# EAGLE design 100 EMBED 1 (EAGLE 5.11)
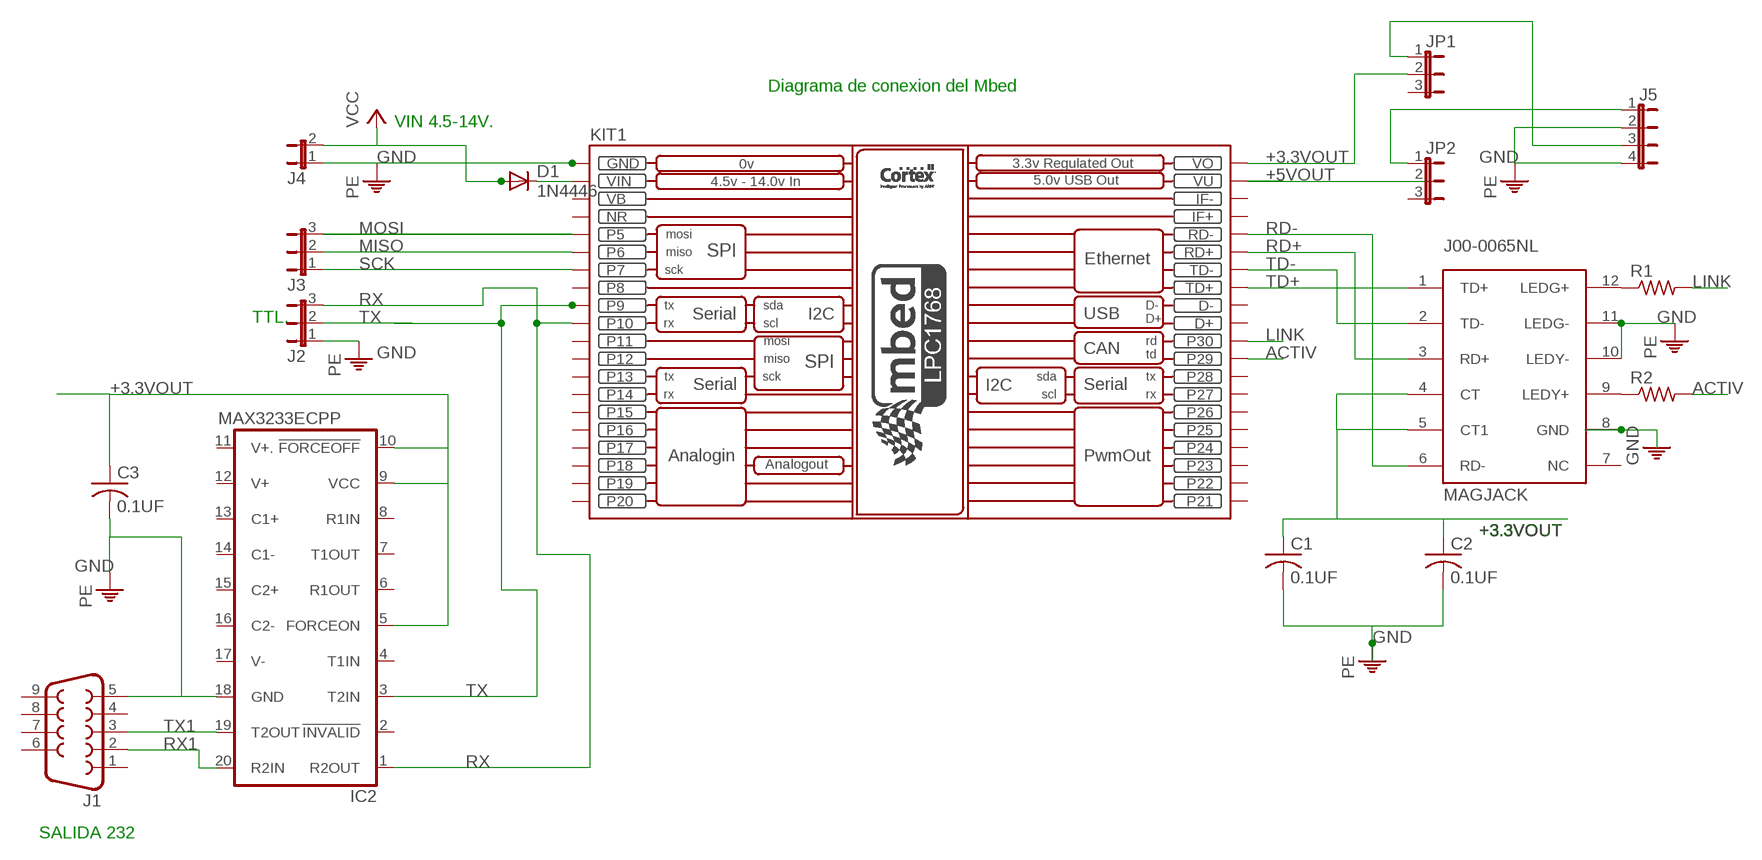
[diagram p0: schematic, sheet 1]

## Parts
C1  0.1UF  C-US025-060X050  [C025-060X050]
C2  0.1UF  C-US025-060X050  [C025-060X050]
C3  0.1UF  C-US025-060X050  [C025-060X050]
D1  1N4446  [DO35-10]
IC2  MAX3233ECPP  [DIL20]
J00-0065NL  MAGJACK  [MAGJACRJ45-1]
J1  DB9  [7457814]
J2  JP2E  [JP2]
J3  JP2E  [JP2]
J4  JP1E  [JP1]
J5  JP4E  [JP4]
JP1  JP2E  [JP2]
JP2  JP2E  [JP2]
KIT1  MBED_NXP_LPC1768  [MBED-KIT]
R1  R-US_0204/5  [0204/5]
R2  R-US_0204/5  [0204/5]

## Nets
+3.3VOUT: C1.1 C2.1 C3.1 IC2.5(FORCEON) IC2.9(VCC) IC2.10(!FORCEOFF) J00-0065NL.4(CT) J00-0065NL.5(CT1) JP1.2 KIT1.VOUT(VO)
+5VOUT: JP2.2 KIT1.VU
ACTIV: KIT1.P$29(P29) R2.2
GND: C1.2 C2.2 C3.2 IC2.18(GND) J00-0065NL.8(GND) J00-0065NL.10(LEDY-) J00-0065NL.11(LEDG-) J1.5 J2.1 J4.1 J5.2 J5.4 KIT1.GND ; supply symbol labelled PE
LINK: KIT1.P$30(P30) R1.2
MISO: J3.2 KIT1.P$6(P6)
MOSI: J3.3 KIT1.P$5(P5)
N$3: J00-0065NL.12(LEDG+) R1.1
N$4: J00-0065NL.9(LEDY+) R2.1
N$5: D1.C KIT1.VIN
N$10: J5.3 JP1.1
N$11: J5.1 JP2.1
RD+: J00-0065NL.3(RD+) KIT1.RD+
RD-: J00-0065NL.6(RD-) KIT1.RD-
RX: IC2.1(R2OUT) J2.3 KIT1.P$10(P10)
RX1: IC2.20(R2IN) J1.2
SCK: J3.1 KIT1.P$7(P7)
TD+: J00-0065NL.1(TD+) KIT1.TD+
TD-: J00-0065NL.2(TD-) KIT1.TD-
TX: IC2.3(T2IN) J2.2 KIT1.P$9(P9)
TX1: IC2.19(T2OUT) J1.3
VCC: D1.A J4.2
Unconnected: IC2.2(!INVALID) IC2.4(T1IN) IC2.6(R1OUT) IC2.7(T1OUT) IC2.8(R1IN) IC2.11(V+.) IC2.12(V+) IC2.13(C1+) IC2.14(C1-) IC2.15(C2+) IC2.16(C2-) IC2.17(V-) J1.1 J1.4 J1.6 J1.7 J1.8 J1.9 JP1.3 JP2.3 KIT1.D+ KIT1.D- KIT1.IF+ KIT1.IF- KIT1.P$8(P8) KIT1.P$11(P11) KIT1.P$12(P12) KIT1.P$13(P13) KIT1.P$14(P14) KIT1.P$15(P15) KIT1.P$16(P16) KIT1.P$17(P17) KIT1.P$18(P18) KIT1.P$19(P19) KIT1.P$20(P20) KIT1.P$21(P21) KIT1.P$22(P22) KIT1.P$23(P23) KIT1.P$24(P24) KIT1.P$25(P25) KIT1.P$26(P26) KIT1.P$27(P27) KIT1.P$28(P28)

## Notes on the sheet
- Diagrama de conexion del Mbed | Diagramama de conexion del MBED
- VIN 4.5-14V.
- TTL.
- +3.3VOUT | +3.3VOUT | +3.3VOUT | +3.3VOUT
- SALIDA 232

## Power pins joined to a net without a drawn wire
NC: J00-0065NL.7(NC)
NR: KIT1.NR
VB: KIT1.VB

## Library data of the parts
C1-C3 = rcl:C-US: CAPACITOR, American symbol
D1 = diode:1N4446: DIODE high speed (Philips)
IC2 = max3233mois:MAX3233E: Dual RS-232 Transceivers with Internal Capacitors ±15kV ESD-Protected, 1µA, 250kbps, 3.3V/5V Source: http://datasheets.maxim-ic.com/en/ds/MAX3233E-MAX3235E.pdf
J00-0065NL = morethanall_magjack:MAGJACK: MORETHANALL MagJack RJ45 with built-in magnetics. Part no. MJF13T3L-KF06B3YG-0808
J1 = ADS:DB9: DB9 Connector
J2 J3 JP1 JP2 = jumper:JP2E: JUMPER
J4 = jumper:JP1E: JUMPER
J5 = jumper:JP4E: JUMPER
KIT1 = SOCKET CONVERTIDOR de MBED_v2.1:MBED_NXP_LPC1768: Mbed LPC1768 - ARM CORTEX v2.1 * Schematic symbol is now placed in eagles's default raster. *The pads diameter are suitable for routing between mbed pins * mbed pads are 0.8 mm drill diameter. --------------------------------------------- Created by: Mohamed Yousry *Alexandria, Egypt *Email: mohamed.yousry@ieeegoldegypt.org
R1 R2 = rcl:R-US_: RESISTOR, American symbol

## Board
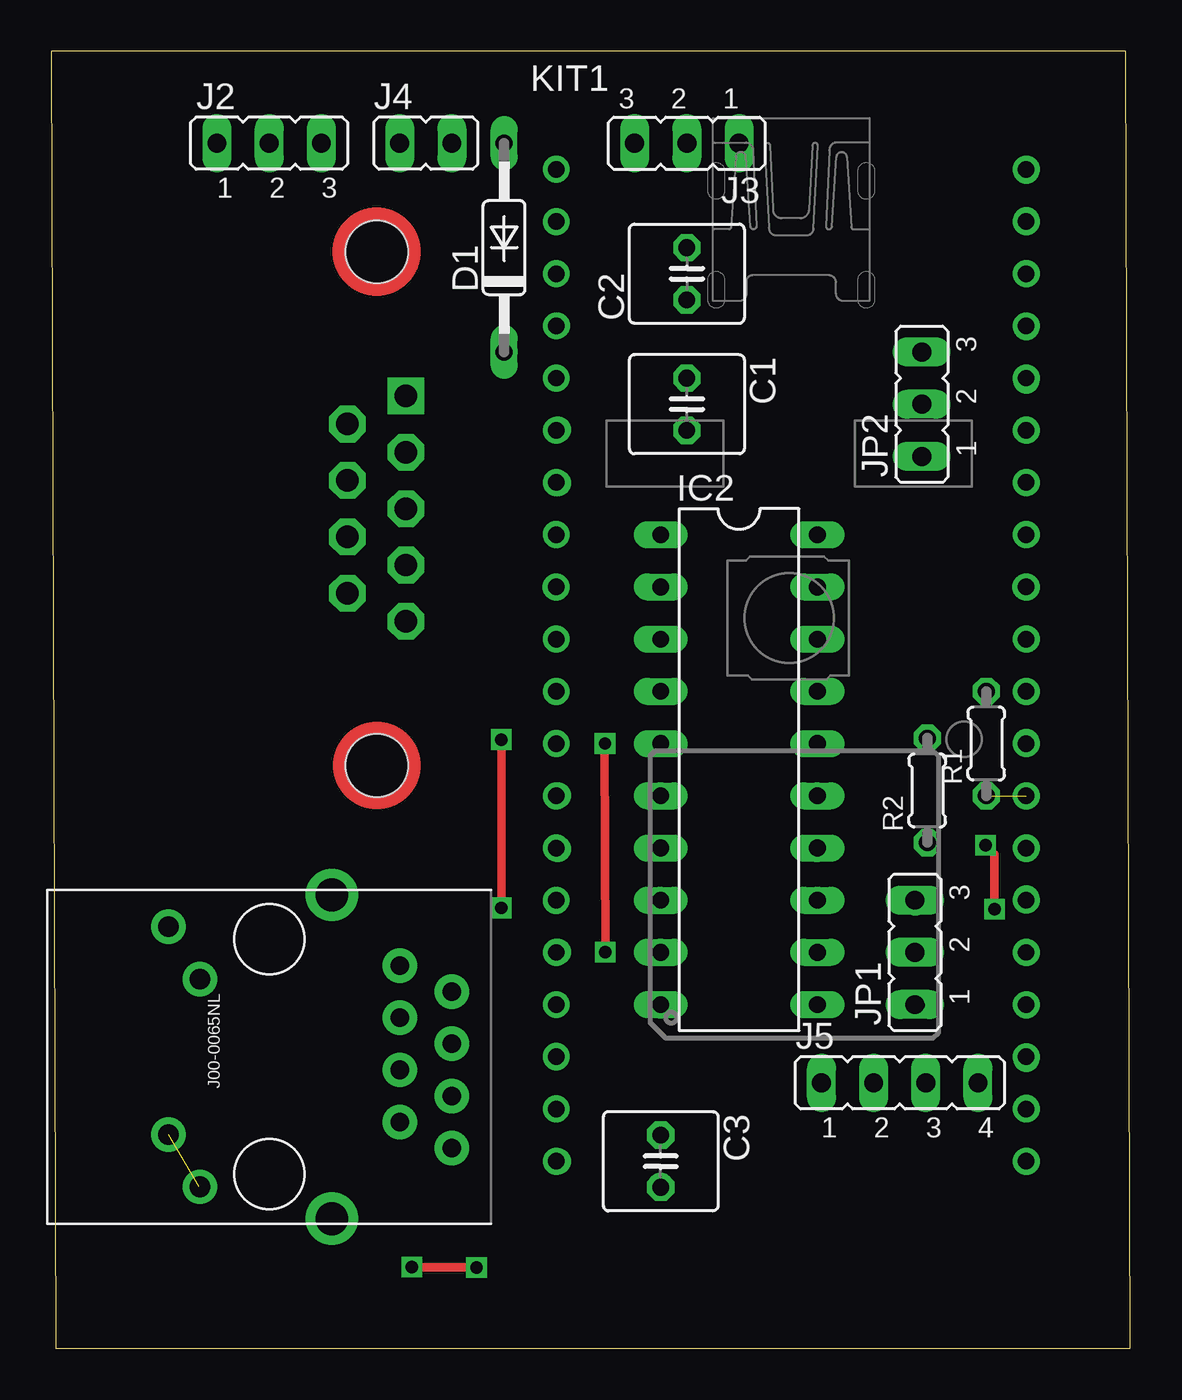
[diagram p1: board, top side]
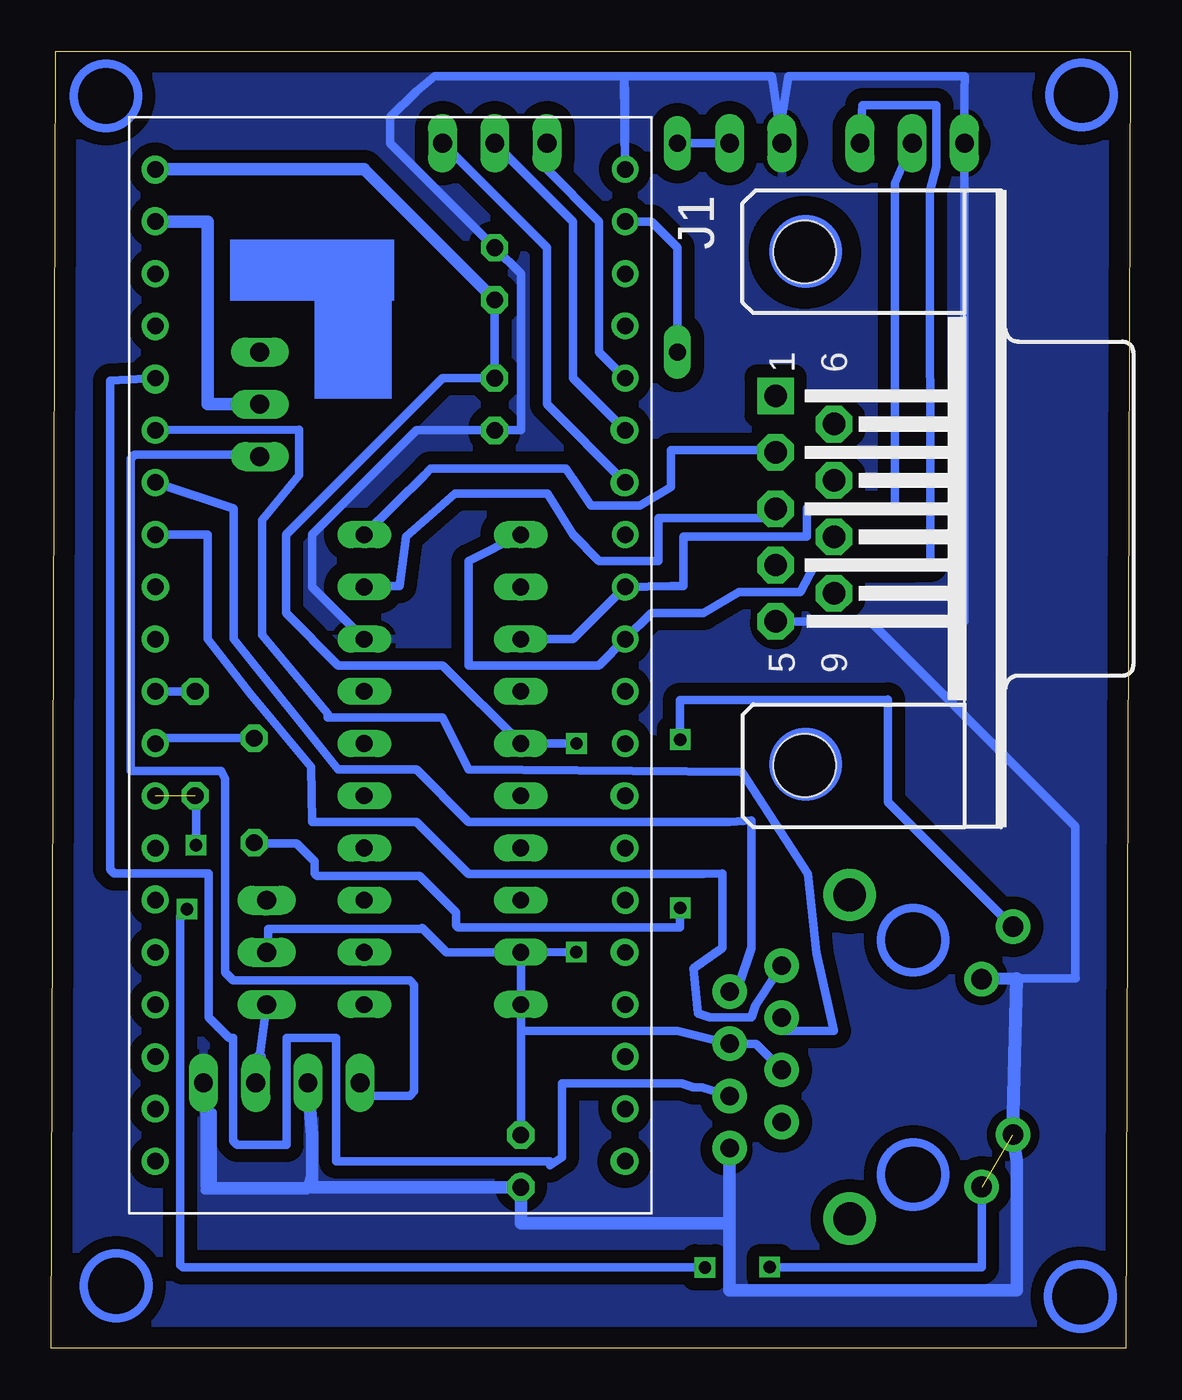
[diagram p2: board, bottom side, seen from below]

Size 52.49 x 63.09 mm. Coordinates in mm from the lower left corner, seen from the top.
Outline: 0.22,0 52.49,0 52.27,63.09 0,63.09 0.22,0
Copper layers (1*16): Top 0.035mm / dielectric 1.5mm / Bottom 0.035mm
Design rules "default *": minimum track width 10mil, minimum drill 24mil, track to track 25mil, track to pad 25mil, pad to pad 25mil, via to via 25mil, smd to smd 25mil, copper to edge 40mil, drill to drill 8mil, minimum pad ring 10mil, minimum via ring 8mil, stop-mask expansion 4mil, vias tented up to drill 0mil, thermal gap 10mil

### Footprints (pad centres in the part's own frame; a part is rotated, then mirrored left to right if it is on the bottom)
C025-060X050 = drill 0.813 octagon: 1 -1.27,0; 2 1.27,0
DO35-10 = drill 0.813 long: A 5.08,0; C -5.08,0
DIL20 = drill 0.813 long: 1 -11.43,-3.81; 2 -8.89,-3.81; 3 -6.35,-3.81; 4 -3.81,-3.81; 5 -1.27,-3.81; 6 1.27,-3.81; 7 3.81,-3.81; 8 6.35,-3.81; 9 8.89,-3.81; 10 11.43,-3.81; 11 11.43,3.81; 12 8.89,3.81; 13 6.35,3.81; 14 3.81,3.81; 15 1.27,3.81; 16 -1.27,3.81; 17 -3.81,3.81; 18 -6.35,3.81; 19 -8.89,3.81; 20 -11.43,3.81
MAGJACRJ45-1 = drill 0.9 pad 1.676 round: 1 4.445,-6.35; 2 3.175,-8.89; 3 1.905,-6.35; 4 0.635,-8.89; 5 -0.635,-6.35; 6 -1.905,-8.89; 7 -3.175,-6.35; 8 -4.445,-8.89 | drill 1 pad 1.676 round: 9 6.325,4.9; 10 3.785,3.38; 11 -3.785,4.9; 12 -6.325,3.38 | drill 1.6 pad 2.54 round: S1 -7.875,-3.05; S2 7.875,-3.05
7457814 = drill 1.092 pad 1.778 square: 1 -5.486,-7.925 | drill 1.092 pad 1.778 octagon: 2 -2.743,-7.925; 3 0,-7.925; 4 2.743,-7.925; 5 5.486,-7.925; 6 -4.115,-5.08; 7 -1.372,-5.08; 8 1.372,-5.08; 9 4.115,-5.08 | hole 3.048: -12.497,-6.502; 12.497,-6.502
JP2 = drill 0.914 long: 1 -2.54,0; 2 0,0; 3 2.54,0
JP1 = drill 0.914 long: 1 0,-1.27; 2 0,1.27
JP4 = drill 0.914 long: 1 -3.81,0; 2 -1.27,0; 3 1.27,0; 4 3.81,0
MBED-KIT = drill 0.8 round: D+ 11.43,1.27; D- 11.43,3.81; GND -11.43,24.13; IF+ 11.43,16.51; IF- 11.43,19.05; NR -11.43,16.51; P$5 -11.43,13.97; P$6 -11.43,11.43; P$7 -11.43,8.89; P$8 -11.43,6.35; P$9 -11.43,3.81; P$10 -11.43,1.27; P$11 -11.43,-1.27; P$12 -11.43,-3.81; P$13 -11.43,-6.35; P$14 -11.43,-8.89; P$15 -11.43,-11.43; P$16 -11.43,-13.97; P$17 -11.43,-16.51; P$18 -11.43,-19.05; P$19 -11.43,-21.59; P$20 -11.43,-24.13; P$21 11.43,-24.13; P$22 11.43,-21.59; P$23 11.43,-19.05; P$24 11.43,-16.51; P$25 11.43,-13.97; P$26 11.43,-11.43; P$27 11.43,-8.89; P$28 11.43,-6.35; P$29 11.43,-3.81; P$30 11.43,-1.27; RD+ 11.43,11.43; RD- 11.43,13.97; TD+ 11.43,6.35; TD- 11.43,8.89; VB -11.43,19.05; VIN -11.43,21.59; VOUT 11.43,24.13; VU 11.43,21.59
0204/5 = drill 0.813 octagon: 1 -2.54,0; 2 2.54,0

### Placement (x,y rotation side)
C1  30.92,45.92 270 top
C2  30.92,52.27 90 top
C3  29.65,9.09 270 top
D1  22.03,53.54 90 top
IC2  33.46,28.14 270 top
J00-0065NL  10.6,14.17 90 top
J1  9.33,40.84 270 bottom
J2  10.6,58.62 0 top
J3  30.92,58.62 180 top
J4  18.22,58.62 270 top
J5  41.28,12.9 0 top
JP1  42.02,19.25 90 top
JP2  42.35,45.92 90 top
KIT1  36,33.22 0 top
R1  45.49,29.41 90 top
R2  42.62,27.13 90 top

### Tracks (layer width: path | path; a pad name or v marks a point on that pad's centre or on a via)
+3.3VOUT  (via drill 0.6)
  Top 0.406: v26.94,29.42 26.92,29.4 v26.95,19.27
  Bottom 0.406: IC2.9 IC2.10 29.65,15.44 | J00-0065NL.5 18.22,14.81 J00-0065NL.4 22.03,15.44 29.65,15.44 | C2.1 C1.1 33.46,47.19 41.08,39.57 41.08,35.76 38.54,33.22 33.46,33.22 IC2.5 v26.94,29.42 | 29.65,15.44 C3.1 | JP1.2 41.95,19.25 41.95,20.4 34.45,20.4 34.45,20.43 33.27,19.25 IC2.9 | v26.95,19.27 29.08,19.25 IC2.9
  Bottom 0.61: KIT1.VOUT 37.27,57.35 C2.1
+5VOUT
  Bottom 0.61: KIT1.VU 44.89,54.81 44.89,45.92 JP2.2
ACTIV
  Bottom 0.406: 47.44,29.68 KIT1.P$29 47.44,29.68 | R2.2 47.43,29.68 | 47.43,29.68 47.44,29.68 | R2.2 47.43,29.68 | 47.43,29.68 47.44,29.68 | R2.2 47.43,29.68 | 47.43,29.68 47.44,29.68 | 47.43,29.68 R2.2
GND
  Bottom 0.406: IC2.18 39.81,37.03 39.81,39.57 34.73,44.65 C1.2 29.65,44.65 29.65,52.27 C2.2 36,58.62 36,59.89 34.73,61.16 33.84,61.88 24.64,61.88 | 39.81,10.36 39.84,8.48 40.04,7.88 44.64,7.88 | 44.64,7.88 45.04,7.88 45.04,12.28 | 45.04,12.28 44.84,11.48 44.64,11.48 44.64,7.88 | 44.64,7.88 45.04,7.68 40.04,7.68 | 45.04,12.28 J5.4 | 24.64,61.88 17.44,61.88 J4.1 16.95,59.89 16.64,61.88 8.04,61.88 8.06,61.16 J2.1 8.06,39.22 8.07,35.35 J1.5 12.64,35.36 2.67,25.39 2.67,18.03 2.64,18 7.18,18 J00-0065NL.10 | 24.64,61.88 24.57,61.16 KIT1.GND 24.64,61.88
  Bottom 0.61: J5.2 39.81,10.36 39.81,7.82 C3.2 29.65,6.08 19.49,6.08 | 19.49,6.08 19.49,2.81 5.52,2.81 5.52,9.09 | 19.49,6.08 J00-0065NL.8 | 5.52,9.09 J00-0065NL.11 | J00-0065NL.11 5.52,17.98 | 5.52,17.98 J00-0065NL.10 | J00-0065NL.11 5.52,17.98 | 5.71,10.39 5.53,17.98 | 5.52,9.09 J00-0065NL.11 | 5.72,10.39 5.54,17.98
  pour Bottom: 54.04,63.88 53.84,63.88 53.84,0.88 -1.56,0.88 -2.96,0.88 -2.96,64.08 -2.36,64.08
LINK
  Bottom 0.406: R1.2 KIT1.P$30
MISO
  Bottom 0.406: J3.2 27.11,54.81 27.11,47.19 KIT1.P$6
MOSI
  Bottom 0.406: KIT1.P$5 25.84,48.46 25.84,54.81 28.38,57.35 J3.3
N$2  (via drill 0.5 pad 1.27)
  other vias: 24.64,26.88
N$3  (via drill 0.6)
  Top 0.406: v45.46,24.46 45.89,24.03 v45.89,21.35 | v20.69,3.92 20.67,3.94 v17.53,3.94
  Bottom 0.406: R1.1 45.46,26.84 v45.46,24.46 | v45.89,21.35 46.22,21.02 46.22,4.03 46.11,3.92 v20.69,3.92 | v17.53,3.94 7.23,3.94 7.22,3.95 J00-0065NL.12
N$4  (via drill 0.6)
  Top 0.406: v21.89,29.61 v21.89,21.42
  Bottom 0.406: R2.1 42.59,24.57 40.57,24.57 39.68,23.68 39.68,23.1 39.56,22.98 34.58,22.98 32.8,21.2 32.8,20.56 32.71,20.47 21.89,20.47 v21.89,21.42 | J00-0065NL.9 11.78,26.58 11.78,31.56 11.81,31.53 21.89,31.53 v21.89,29.61
N$5
  Bottom 0.406: KIT1.VIN 23.3,54.81 22.03,53.54 D1.C
N$10
  Bottom 0.406: 42.35,14.17 JP1.1
  Bottom 0.61: J5.3 42.35,14.17
N$11
  Bottom 0.406: JP2.1 42.45,43.48 48.44,43.48 48.64,43.28 48.64,28.08 44.24,28.08 44.04,27.68 44.04,18.28 43.64,17.88 35.04,17.88 34.84,17.68 34.84,12.48 35.04,12.28 37.64,12.28 37.47,12.45 J5.1
N$32  (via drill 0.5 pad 1.27)
  other vias: 14.38,44.94
N$33  (via drill 0.5 pad 1.27)
  other vias: 17.24,43.55
N$34  (via drill 0.5 pad 1.27)
  other vias: 17.27,46.32
N$35  (via drill 0.5 pad 1.27)
  other vias: 14.4,42.22
N$36  (via drill 0.5 pad 1.27)
  other vias: 14.44,39.48
N$37  (via drill 0.5 pad 1.27)
  other vias: 14.42,36.72
N$38  (via drill 0.5 pad 1.27)
  other vias: 17.24,38.08
N$39  (via drill 0.5 pad 1.27)
  other vias: 17.24,35.28
N$40  (via drill 0.5 pad 1.27)
  other vias: 24.58,57.37
N$41  (via drill 0.5 pad 1.27)
  other vias: 24.59,54.81
N$42  (via drill 0.5 pad 1.27)
  other vias: 24.56,52.27
N$43  (via drill 0.5 pad 1.27)
  other vias: 24.6,49.76
N$44  (via drill 0.5 pad 1.27)
  other vias: 24.57,47.2
N$45  (via drill 0.5 pad 1.27)
  other vias: 24.64,44.68
N$46  (via drill 0.5 pad 1.27)
  other vias: 24.64,42.08
N$47  (via drill 0.5 pad 1.27)
  other vias: 24.56,39.61
N$48  (via drill 0.5 pad 1.27)
  other vias: 24.54,37.03
N$49  (via drill 0.5 pad 1.27)
  other vias: 24.57,34.51
N$50  (via drill 0.5 pad 1.27)
  other vias: 45.5,31.96
N$53  (via drill 0.5 pad 1.27)
  other vias: 24.64,24.28
N$54  (via drill 0.5 pad 1.27)
  other vias: 24.55,21.77
N$55  (via drill 0.5 pad 1.27)
  other vias: 24.64,19.28
N$56  (via drill 0.5 pad 1.27)
  other vias: 24.56,16.72
N$57  (via drill 0.5 pad 1.27)
  other vias: 24.56,14.21
N$58  (via drill 0.5 pad 1.27)
  other vias: 24.57,11.63
N$59  (via drill 0.5 pad 1.27)
  other vias: 24.64,9.08
N$60  (via drill 0.5 pad 1.27)
  other vias: 29.64,7.88
N$61  (via drill 0.5 pad 1.27)
  other vias: 29.65,10.38
N$62  (via drill 0.5 pad 1.27)
  other vias: 29.64,16.68
N$63  (via drill 0.5 pad 1.27)
  other vias: 29.64,19.28
N$64  (via drill 0.5 pad 1.27)
  other vias: 29.63,21.81
N$65  (via drill 0.5 pad 1.27)
  other vias: 29.63,24.34
N$66  (via drill 0.5 pad 1.27)
  other vias: 29.64,26.88
N$67  (via drill 0.5 pad 1.27)
  other vias: 29.64,29.39
N$68  (via drill 0.5 pad 1.27)
  other vias: 29.64,31.92
N$69  (via drill 0.5 pad 1.27)
  other vias: 29.64,34.48
N$70  (via drill 0.5 pad 1.27)
  other vias: 29.66,37
N$71  (via drill 0.5 pad 1.27)
  other vias: 29.64,39.55
N$72  (via drill 0.5 pad 1.27)
  other vias: 37.26,39.56
N$73  (via drill 0.5 pad 1.27)
  other vias: 37.26,37.03
N$74  (via drill 0.5 pad 1.27)
  other vias: 37.3,34.49
N$75  (via drill 0.5 pad 1.27)
  other vias: 37.27,31.95
N$76  (via drill 0.5 pad 1.27)
  other vias: 37.29,29.42
N$77  (via drill 0.5 pad 1.27)
  other vias: 37.26,26.88
N$78  (via drill 0.5 pad 1.27)
  other vias: 37.25,24.3
N$79  (via drill 0.5 pad 1.27)
  other vias: 37.27,21.79
N$80  (via drill 0.5 pad 1.27)
  other vias: 37.24,19.24
N$81  (via drill 0.5 pad 1.27)
  other vias: 37.24,16.73
N$82  (via drill 0.5 pad 1.27)
  other vias: 42.24,16.68
N$83  (via drill 0.5 pad 1.27)
  other vias: 42.04,19.28
N$84  (via drill 0.5 pad 1.27)
  other vias: 42.04,21.68
N$85  (via drill 0.5 pad 1.27)
  other vias: 42.61,24.59
N$86  (via drill 0.5 pad 1.27)
  other vias: 42.64,29.68
N$87  (via drill 0.5 pad 1.27)
  other vias: 47.44,57.28
N$88  (via drill 0.5 pad 1.27)
  other vias: 47.44,54.88
N$89  (via drill 0.5 pad 1.27)
  other vias: 47.44,52.28
N$90  (via drill 0.5 pad 1.27)
  other vias: 47.44,49.68
N$91  (via drill 0.5 pad 1.27)
  other vias: 47.44,47.08
N$92  (via drill 0.5 pad 1.27)
  other vias: 47.44,44.68
N$93  (via drill 0.5 pad 1.27)
  other vias: 47.44,42.08
N$94  (via drill 0.5 pad 1.27)
  other vias: 47.43,39.57
N$95  (via drill 0.5 pad 1.27)
  other vias: 47.39,37.02
N$96  (via drill 0.5 pad 1.27)
  other vias: 47.44,34.48
N$97  (via drill 0.5 pad 1.27)
  other vias: 47.41,31.94
N$98  (via drill 0.5 pad 1.27)
  other vias: 47.44,29.48
N$99  (via drill 0.5 pad 1.27)  (1 unrouted)
  other vias: 47.44,26.87 45.5,26.87
N$100  (via drill 0.5 pad 1.27)
  other vias: 47.44,24.28
N$101  (via drill 0.5 pad 1.27)
  other vias: 47.44,21.88
N$102  (via drill 0.5 pad 1.27)
  other vias: 47.44,19.28
N$103  (via drill 0.5 pad 1.27)
  other vias: 47.44,16.68
N$104  (via drill 0.5 pad 1.27)
  other vias: 47.44,14.08
N$105  (via drill 0.5 pad 1.27)
  other vias: 47.44,11.68
N$106  (via drill 0.5 pad 1.27)
  other vias: 47.42,9.1
N$107  (via drill 0.5 pad 1.27)
  other vias: 33.46,58.61
N$108  (via drill 0.5 pad 1.27)
  other vias: 30.92,58.62
N$109  (via drill 0.5 pad 1.27)
  other vias: 28.37,58.62
N$110  (via drill 0.5 pad 1.27)
  other vias: 22.01,58.62
N$111  (via drill 0.5 pad 1.27)
  other vias: 19.5,58.63
N$112  (via drill 0.5 pad 1.27)
  other vias: 16.95,58.63
N$113  (via drill 0.5 pad 1.27)
  other vias: 13.16,58.59
N$114  (via drill 0.5 pad 1.27)
  other vias: 10.6,58.57
N$115  (via drill 0.5 pad 1.27)
  other vias: 8.08,58.62
N$116  (via drill 0.5 pad 1.27)
  other vias: 30.93,53.57
N$117  (via drill 0.5 pad 1.27)
  other vias: 30.9,51.01
N$118  (via drill 0.5 pad 1.27)
  other vias: 30.91,47.21
N$119  (via drill 0.5 pad 1.27)
  other vias: 30.93,44.66
N$120  (via drill 0.5 pad 1.27)
  other vias: 16.95,18.65
N$121  (via drill 0.5 pad 1.27)
  other vias: 19.49,17.36
N$122  (via drill 0.5 pad 1.27)
  other vias: 19.5,14.82
N$123  (via drill 0.5 pad 1.27)
  other vias: 16.98,16.08
N$124  (via drill 0.5 pad 1.27)
  other vias: 16.96,13.53
N$125  (via drill 0.5 pad 1.27)
  other vias: 19.49,12.27
N$126  (via drill 0.5 pad 1.27)
  other vias: 19.64,9.68
N$127  (via drill 0.5 pad 1.27)
  other vias: 16.96,11.01
N$128  (via drill 0.5 pad 1.27)
  other vias: 5.71,20.49
N$130  (via drill 0.5 pad 1.27)  (1 unrouted)
  other vias: 5.7,10.38 7.2,7.84
N$132  (via drill 0.5 pad 1.27)
  other vias: 7.23,17.97
N$133  (via drill 0.5 pad 1.27)
  other vias: 42.34,48.46
N$134  (via drill 0.5 pad 1.27)
  other vias: 42.38,45.9
N$135  (via drill 0.5 pad 1.27)
  other vias: 42.36,43.38
N$136  (via drill 0.5 pad 1.27)
  other vias: 17.24,40.88
N$137  (via drill 0.5 pad 1.27)
  other vias: 22.04,48.48
RD+
  Bottom 0.406: J00-0065NL.3 16.95,15.44 14.41,15.44 15.27,19.22 15.68,23.06 18.89,28.03 32.19,28.14 33.46,30.68 39.04,30.68 39.04,30.88 42.24,34.68 42.24,40.28 40.44,42.48 40.44,44.68 KIT1.RD+
RD-
  Bottom 0.406: J00-0065NL.6 20.84,12.68 21.24,12.68 21.84,12.88 27.64,12.88 27.64,9.28 28.24,8.88 28.24,9.08 38.64,9.08 38.64,15.08 41.04,15.08 41.04,9.88 43.44,9.88 43.64,10.08 43.64,15.08 43.84,15.08 44.84,16.08 44.84,23.08 49.44,23.08 49.64,23.28 49.64,47.08 KIT1.RD-
RX
  Bottom 0.406: IC2.1 32.19,38.3 32.19,33.22 25.84,33.22 KIT1.P$10 23.3,35.76 20.76,35.76 19.04,36.78 16.04,36.78 15.36,38.08 10.58,38.08 9.71,38.1 9.74,56.28 9.44,57.48 9.44,60.48 13.04,60.48 J2.3
RX1
  Bottom 0.406: IC2.20 34.34,42.48 34.04,42.78 27.44,42.78 26.24,40.98 23.84,40.98 22.34,41.88 22.34,43.68 17.84,43.68 J1.2
SCK
  Bottom 0.406: J3.1 28.38,53.54 28.38,45.92 KIT1.P$7
TD+
  Bottom 0.406: KIT1.TD+ 44.89,39.57 44.89,34.49 42.84,31.88 39.84,28.28 39.81,25.6 34.73,25.6 32.19,23.06 20.76,23.06 19.84,23.08 19.84,19.48 21.24,18.48 21.04,16.28 20.44,16.08 18.44,16.08 18.24,16.68 17.24,18.18 16.95,18.47 J00-0065NL.1
TD-
  Bottom 0.406: KIT1.TD- 43.62,40.84 43.62,34.49 38.54,28.14 34.73,28.14 32.19,25.6 19.49,25.6 18.44,25.68 18.44,19.48 19.04,17.68 19.49,17.68 J00-0065NL.2
TX
  Bottom 0.406: IC2.3 27.11,34.49 KIT1.P$9 22.34,37.08 21.74,37.08 21.74,39.48 15.74,39.48 15.74,40.68 15.74,40.88 11.44,40.88 11.44,56.68 J2.2
TX1
  Bottom 0.406: J1.3 17.54,40.38 22.94,40.38 22.94,38.28 25.84,38.3 27.11,39.57 28.34,41.58 32.84,41.58 35.24,39.48 35.54,37.08 37.27,37.08 IC2.19
VCC
  Bottom 0.406: J4.2 D1.A
(copper drawn outside any net)
  shapes: Bottom area x2, Bottom circle x8